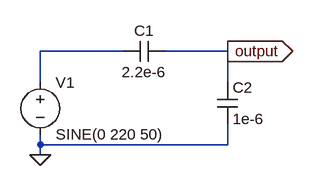
[diagram p0: schematic capacitive_voltage_divider.asc]
capacitive_voltage_divider.asc, the LTspice schematic file:
Version 4
SHEET 1 880 680
WIRE 208 112 80 112
WIRE 368 112 272 112
WIRE 80 160 80 112
WIRE 368 160 368 112
WIRE 80 256 80 240
WIRE 368 256 368 224
WIRE 368 256 80 256
WIRE 80 272 80 256
FLAG 80 272 0
FLAG 368 112 output
IOPIN 368 112 Out
SYMBOL voltage 80 144 R0
WINDOW 123 0 0 Left 0
WINDOW 39 0 0 Left 0
SYMATTR InstName V1
SYMATTR Value SINE(0 220 50)
SYMBOL cap 208 128 R270
WINDOW 0 32 32 VTop 2
WINDOW 3 0 32 VBottom 2
SYMATTR InstName C1
SYMATTR Value 2.2e-6
SYMBOL cap 352 160 R0
SYMATTR InstName C2
SYMATTR Value 1e-6

The netlist it stands for:
* capacitive_voltage_divider.asc
V1 N001 0 SINE(0 220 50)
C1 N001 output 2.2e-6
C2 output 0 1e-6
.backanno
.end